# Altium schematic sheet ACT4088_stepdown_dcdc.SchDoc
size A4
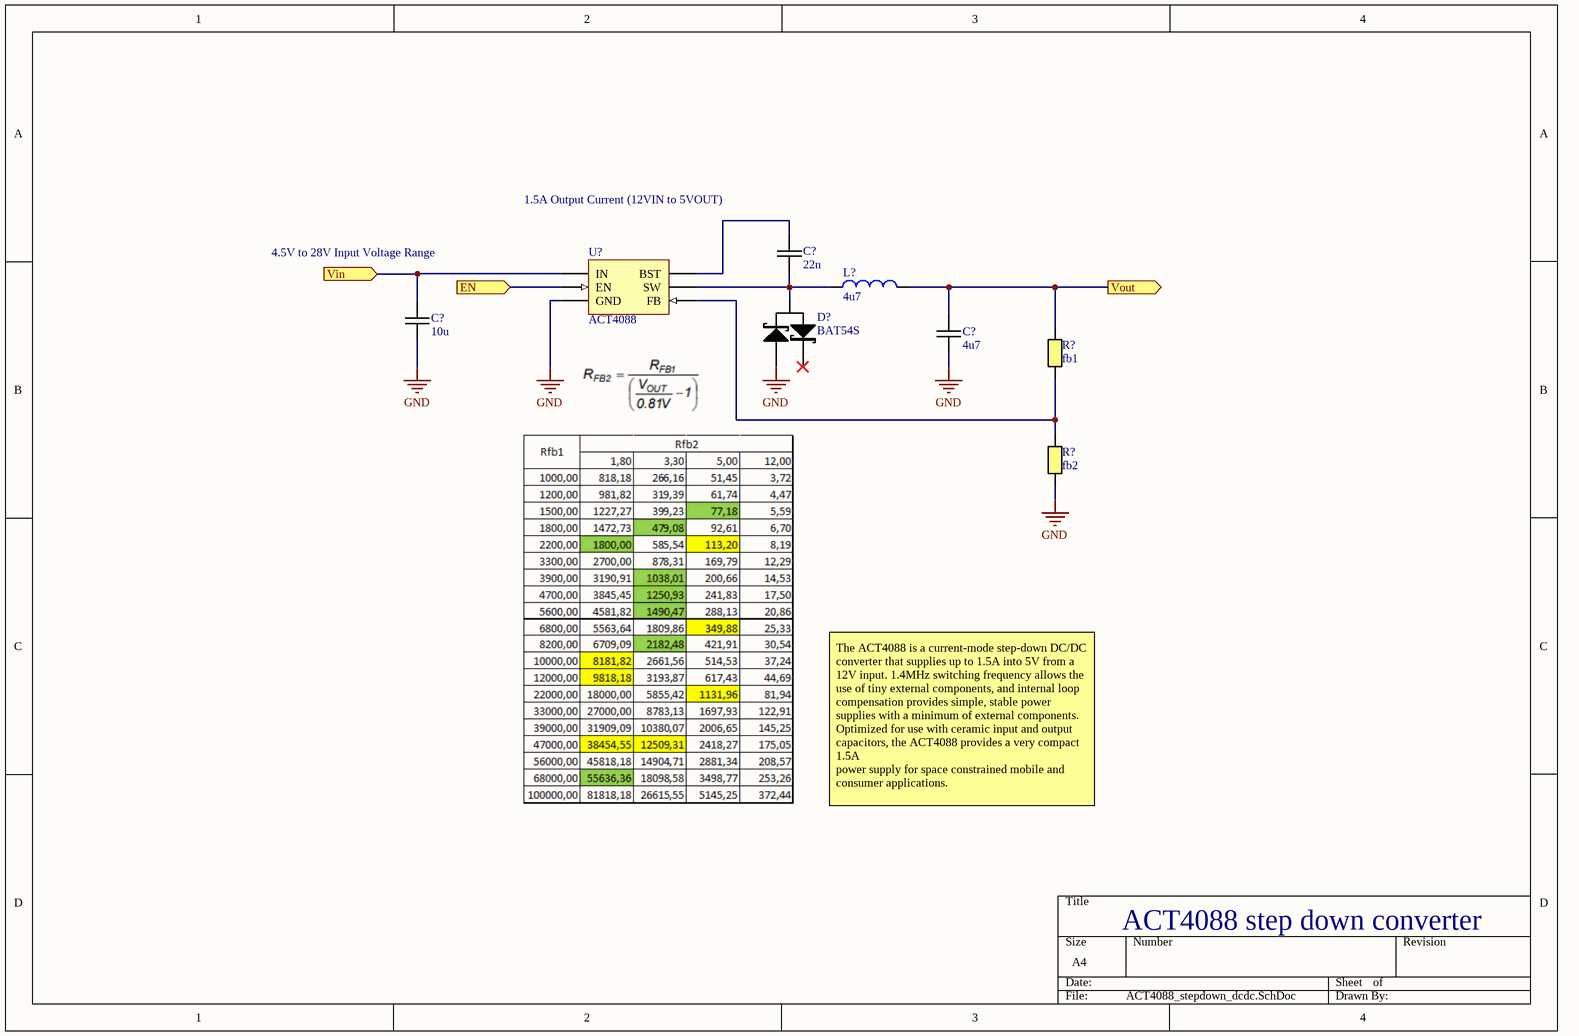
[diagram p0: ACT4088_stepdown_dcdc.SchDoc]

## Parts
(Parts that share a designator on the sheet are numbered #1, #2 ... from top to bottom, then left to right.)
C?#1  22n  [CAPC0603(1608)55_N]
C?#2  10u  [CAPC0805(2012)75_N]
C?#3  4u7  [CAPC0805(2012)75_N]
D?  BAT54S  [SOT23]
L?  4u7  [C_1210]
R?#1  fb1  [RESC0603(1608)_N]
R?#2  fb2  [RESC0603(1608)_N]
U?  ACT4088  [SOT23-6]

## Ports
EN (in), Vin (in), Vout (out)

## Nets
GND: C?#2.2 C?#3.2 D?.1 R?#2.1 U?.5(GND)
EN: U?.3(EN) ; port EN
Vin: C?#2.1 U?.2(IN) ; port Vin
Vout: C?#3.1 L?.2 R?#1.2 ; port Vout
NetC?#1_1: C?#1.1 U?.6(BST)
NetC?#1_2: C?#1.2 D?.3 L?.1 U?.1(SW)
NetR?#1_1: R?#1.1 R?#2.2 U?.4(FB)

Not connected (* = marked no-connect by the designer): D? 2*

## Notes on the sheet
- 1.5A Output Current (12VIN to 5VOUT)
- (near C?#2) 4.5V to 28V Input Voltage Range
- The ACT4088 is a current-mode step-down DC/DC
  converter that supplies up to 1.5A into 5V from a
  12V input. 1.4MHz switching frequency allows the
  use of tiny external components, and internal loop
  compensation provides simple, stable power supplies with a minimum of external components. Optimized for use with ceramic input and output capacitors, the ACT4088 provides a very compact 1.5A
  power supply for space constrained mobile and
  consumer applications.
- ACT4088 step down converter

## Library data of the parts
C?#1-C?#3 = Capacitor M: Ceramic capacitor Medium density
  C?#1: Value: 22n
  C?#2: Value: 10u
  C?#3: Value: 4u7
D? = BAT54S-SOT323: DUAL SCHOTTKY DIODE SERIES; Manufacturer: NXP Semiconductors; Manufacturer Part Number: BAT54SW,115; Voltage - Forward (Vf) (Max) @ If: 800mV @ 100mA; Current - Reverse Leakage @ Vr: 2µA @ 25V; Speed: Small Signal =< 200mA (Io), Any Speed; Diode Configuration: 1 Pair Series Connection; Current - Average Rectified (Io) (per Diode): 200mA (DC); Voltage - DC Reverse (Vr) (Max): 30V; Reverse Recovery Time (trr): 5ns; Supplier 1: Digi-Key; Supplier Part Number 1: 568-1615-2-ND; Mounting Type: Surface Mount; Packaging: Tape & Reel (TR); Package / Case: SC-70-3, SOT-323-3; Diode Type: Schottky; Supplier Part Number: 568-1615-2-ND; Category: Discrete Semiconductor Products; Supplier: Digi-Key; RoHS: RoHS Compliant
L? = Inductor: Value: 4u7
R?#1 R?#2 = Resistor M: Resistor Medium Density
  R?#1: Value: fb1
  R?#2: Value: fb2
U? = ACT4088: current-mode step-down DC/DC  converter that supplies up to 1.5A into 5V from a  12V input. 1.4MHz; Vin: 4.5 ~ 28V; Efficency: 92%; Max current: 1.5A; Freqency: 1.4MHz